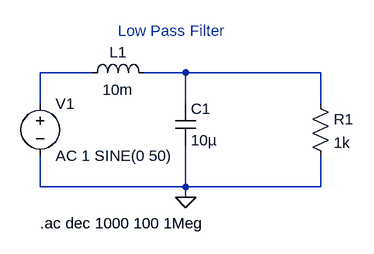
[diagram p0: schematic 3EEC_VELASCO_EXPT7_CKT3.asc]
3EEC_VELASCO_EXPT7_CKT3.asc, the LTspice schematic file:
Version 4
SHEET 1 880 680
WIRE 96 96 16 96
WIRE 240 96 176 96
WIRE 448 96 240 96
WIRE 16 144 16 96
WIRE 240 144 240 96
WIRE 448 144 448 96
WIRE 16 272 16 224
WIRE 240 272 240 208
WIRE 240 272 16 272
WIRE 448 272 448 224
WIRE 448 272 240 272
WIRE 240 288 240 272
FLAG 240 288 0
SYMBOL voltage 16 128 R0
SYMATTR InstName V1
SYMATTR Value AC 1 SINE(0 50)
SYMBOL ind 80 112 R270
WINDOW 0 32 56 VTop 2
WINDOW 3 5 56 VBottom 2
SYMATTR InstName L1
SYMATTR Value 10m
SYMBOL res 432 128 R0
SYMATTR InstName R1
SYMATTR Value 1k
SYMBOL cap 224 144 R0
SYMATTR InstName C1
SYMATTR Value 10µ
TEXT 16 328 Left 2 !.ac dec 1000 100 1Meg
TEXT 136 32 Left 2 ;Low Pass Filter

The netlist it stands for:
* 3EEC_VELASCO_EXPT7_CKT3.asc
V1 N001 0 AC 1 SINE(0 50)
L1 N001 N002 10m
R1 N002 0 1k
C1 N002 0 10µ
.ac dec 1000 100 1Meg
* Low Pass Filter
.backanno
.end